# Altium project LOAD CONTROL_Final.PrjPcb
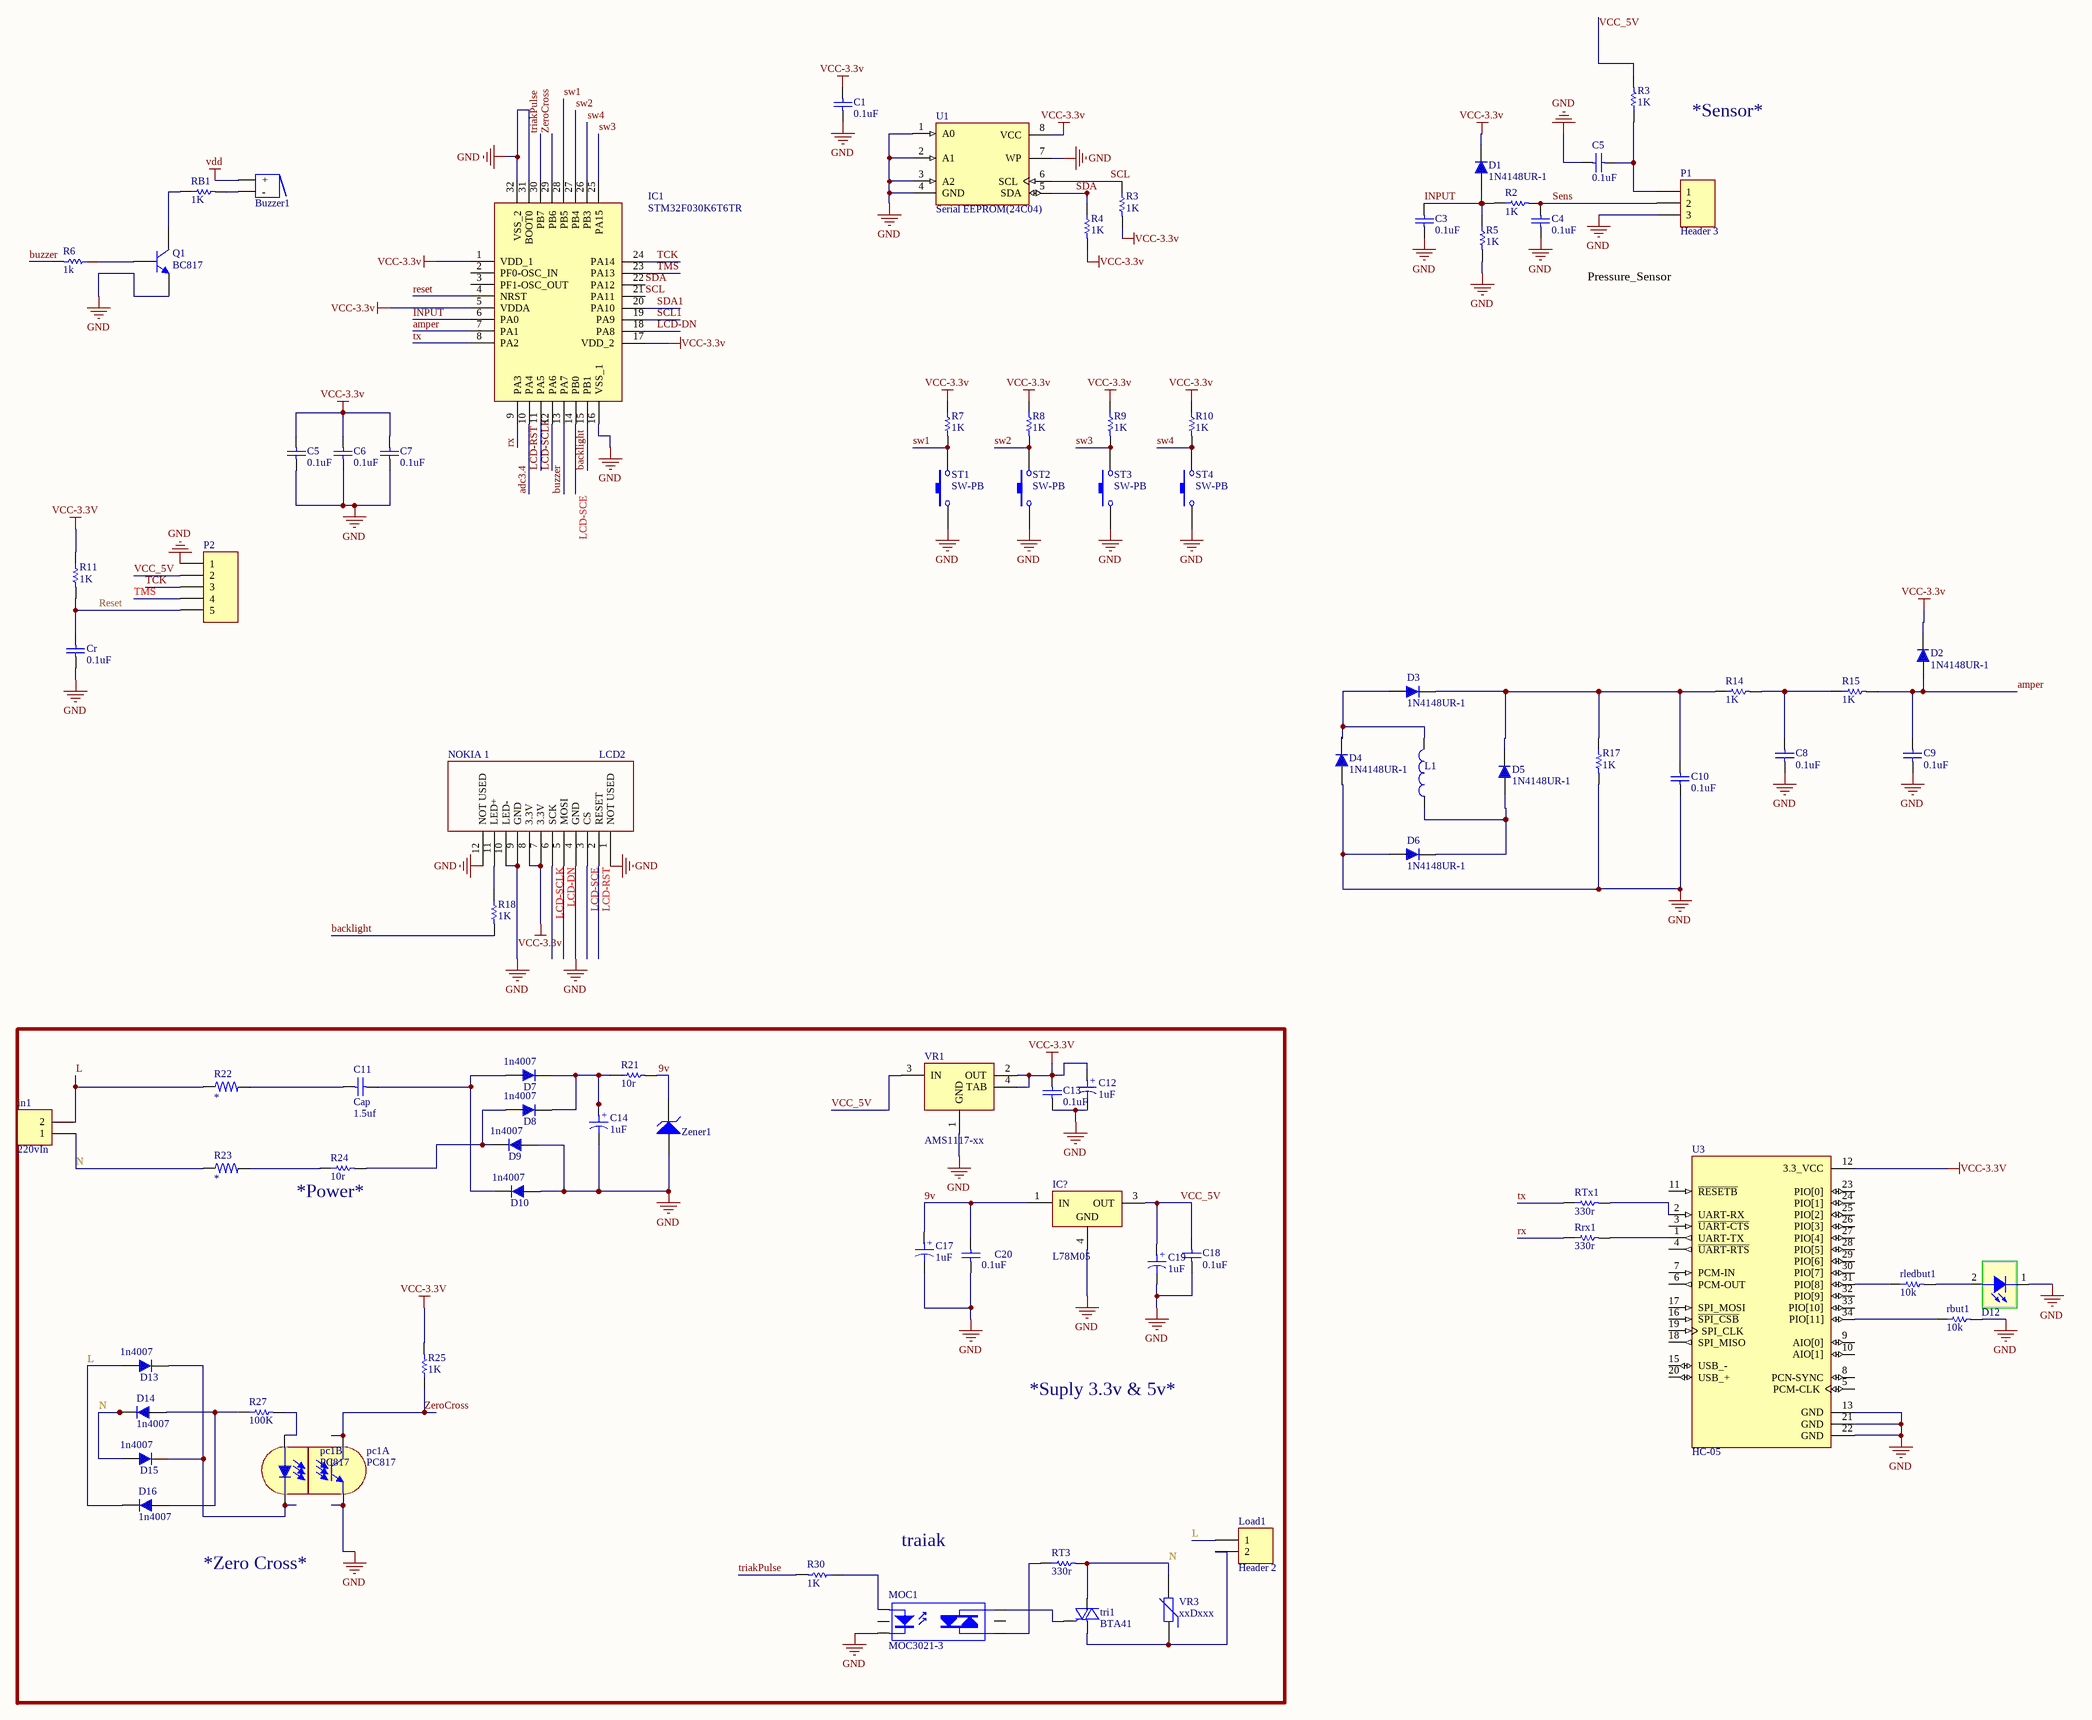
[diagram p0: LOAD CONTROL_Final2.SchDoc]
1 sheet, 84 parts. Net scope: global (net labels, ports and power ports of the same name join across sheets).
Board file: LOAD CONTROL_Final2.PcbDoc

## Sheet LOAD CONTROL_Final2.SchDoc
size A2

### Parts
(Parts that share a designator on the sheet are numbered #1, #2 ... from top to bottom, then left to right.)
Buzzer1  Buzzer  [BUZZER]  (value not drawn)
C1  0.1uF  [CAPC4817X12N]
C3  0.1uF  [CAPC4817X12N]
C4  0.1uF  [CAPC4817X12N]
C5#1  0.1uF  [CAPC4817X12N]
C5#2  0.1uF  [CAPC4817X12N]
C6  0.1uF  [CAPC4817X12N]
C7  0.1uF  [CAPC4817X12N]
C8  0.1uF  [CAPC4817X12N]
C9  0.1uF  [CAPC4817X12N]
C10  0.1uF  [CAPC4817X12N]
C11  Cap  value 1.5uf  [RAD-0.3]
C12  1uF  [Cap electrolitic radial 5x11-2]
C13  0.1uF  [CAPC4817X12N]
C14  1uF  [Cap electrolitic radial 5x11-2]
C17  1uF  [Cap electrolitic radial 5x11-2]
C18  0.1uF  [CAPC4817X12N]
C19  1uF  [Cap electrolitic radial 5x11-2]
C20  0.1uF  [CAPC4817X12N]
Cr  0.1uF  [CAPC4817X12N]
D1  1N4148UR-1  [SOD80, LL-34]
D2  1N4148UR-1  [SOD80, LL-34]
D3  1N4148UR-1  [SOD80, LL-34]
D4  1N4148UR-1  [SOD80, LL-34]
D5  1N4148UR-1  [SOD80, LL-34]
D6  1N4148UR-1  [SOD80, LL-34]
D7  1n4007  [DIOM4629X24N]
D8  1n4007  [DIOM4629X24N]
D9  1n4007  [DIOM4629X24N]
D10  1n4007  [DIOM4629X24N]
D12  SMD 1206 LED  [LED 1206]  (value not drawn)
D13  1n4007  [DIOM4629X24N]
D14  1n4007  [DIOM4629X24N]
D15  1n4007  [DIOM4629X24N]
D16  1n4007  [DIOM4629X24N]
IC1  STM32F030K6T6TR  [QFP80P900X900X160-32N]
IC?  L78M05  [TO-263]
in1  220vIn  [HDR1X2]
L1  0  [ZMC]  (value not drawn)
Load1  Header 2  [HDR1X2]
MOC1  MOC3021-3  [DIP-6]
NOKIA_1  LCD2  [LCD NOKIA 1202]
P1  Header 3  [3PIN]
P2  Header 5  [HDR1X5]  (value not drawn)
pc1  PC817  [SMT Gullwing Lead-Form]  (parts A,B of 2)
Q1  BC817  [SOT23_N]
R2  1K  [RESC4817X04N]
R3#1  1K  [RESC4817X04N]
R3#2  1K  [RESC4817X04N]
R4  1K  [RESC4817X04N]
R5  1K  [RESC4817X04N]
R6  value 1k  [R1206]  (hidden comment: Res Semi)
R7  1K  [RESC4817X04N]
R8  1K  [RESC4817X04N]
R9  1K  [RESC4817X04N]
R10  1K  [RESC4817X04N]
R11  1K  [RESC4817X04N]
R14  1K  [RESC4817X04N]
R15  1K  [RESC4817X04N]
R17  1K  [RESC4817X04N]
R18  1K  [RESC4817X04N]
R21  10r  [RES-(1/2)-Stand]
R22  1614997-1  [RESAD640W45L370D200]  (value not drawn)
R23  1614997-1  [RESAD640W45L370D200]  (value not drawn)
R24  10r  [RES-(1/2)-Stand]
R25  1K  [RESC4817X04N]
R27  100K  [RESC4817X04N]
R30  1K  [RESC4817X04N]
RB1  1K  [RESC4817X04N]
rbut1  10k  [RESC4817X04N]
rledbut1  10k  [RESC4817X04N]
Rrx1  330r  [RESC4817X04N]
RT3  330r  [RESC4817X04N]
RTx1  330r  [RESC4817X04N]
ST1  SW-PB  [PUSH BOTTOM 6*6]
ST2  SW-PB  [PUSH BOTTOM 6*6]
ST3  SW-PB  [PUSH BOTTOM 6*6]
ST4  SW-PB  [PUSH BOTTOM 6*6]
tri1  BTA41  [TO552P1530X450X2110-3B]
U1  Serial EEPROM(24C04)  [SO8_L]
U3  HC-05  [XCVR_HC-05]
VR1  AMS1117-xx  [SOT-223]
VR3  xxDxxx  [14D XXX]
Zener1  Diode Zener  [Diode 1W_Stand]  (value not drawn)

### Nets
GND: C1.1 C3.1 C4.1 C5#1.2 C5#2.1 C6.1 C7.1 C8.1 C9.1 C10.1 C12.2 C13.1 C14.2 C17.2 C18.1 C19.2 C20.1 Cr.1 D4.1 D6.1 D9.1 D10.1 D12.1 IC1.16(VSS_1) IC1.31(BOOT0) IC1.32(VSS_2) IC?.4(GND) MOC1.2(K) NOKIA_1.1(NOT_USED) NOKIA_1.4(GND) NOKIA_1.9(GND) NOKIA_1.10(LED-) NOKIA_1.12(NOT_USED) P1.3 P2.1 pc1.3(E) Q1.2(E) R5.2 R17.2 rbut1.2 ST1.1 ST2.1 ST3.1 ST4.1 U1.1(A0) U1.2(A1) U1.3(A2) U1.4(GND) U1.7(WP) U3.13(GND) U3.21(GND) U3.22(GND) VR1.1(GND) Zener1.1(A)
VCC-3.3v: C1.2 C5#2.2 C6.2 C7.2 C12.1 C13.2 D1.2 D2.2 IC1.1(VDD_1) IC1.5(VDDA) IC1.17(VDD_2) NOKIA_1.7(3.3V) NOKIA_1.8(3.3V) R3#2.2 R4.2 R7.1 R8.1 R9.1 R10.1 R11.1 R25.2 U1.8(VCC) U3.12(3.3_VCC) VR1.2(OUT) VR1.4(TAB)
vdd: Buzzer1.1(+)
9v: C17.1 C20.2 IC?.1(IN) R21.2 Zener1.2(K)
adc3.4: IC1.10(PA4)
amper: C9.2 D2.1 IC1.7(PA1) R15.2
backlight: IC1.15(PB1) R18.2
buzzer: IC1.13(PA7) R6.2
INPUT: C3.2 D1.1 IC1.6(PA0) R2.1 R5.1
L: D13.1 D16.2 in1.2 Load1.1 R22.1
LCD-DN: IC1.18(PA8) NOKIA_1.5(MOSI)
LCD-RST: IC1.11(PA5) NOKIA_1.2(RESET)
LCD-SCE: IC1.14(PB0) NOKIA_1.3(CS)
LCD-SCLK: IC1.12(PA6) NOKIA_1.6(SCK)
N: D14.2 D15.1 in1.1 R23.1 RT3.2 tri1.2(A2) VR3.2
Reset: Cr.2 IC1.4(NRST) P2.5 R11.2
rx: IC1.9(PA3) Rrx1.1
SCL: IC1.21(PA11) R3#2.1 U1.6(SCL)
SCL1: IC1.19(PA9)
SDA: IC1.22(PA12) R4.1 U1.5(SDA)
SDA1: IC1.20(PA10)
Sens: C4.2 P1.2 R2.2
sw1: IC1.28(PB5) R7.2 ST1.2
sw2: IC1.27(PB4) R8.2 ST2.2
sw3: IC1.25(PA15) R9.2 ST3.2
sw4: IC1.26(PB3) R10.2 ST4.2
TCK: IC1.24(PA14) P2.3
TMS: IC1.23(PA13) P2.4
triakPulse: IC1.30(PB7) R30.2
tx: IC1.8(PA2) RTx1.1
VCC_5V: C18.2 C19.1 IC?.3(OUT) P2.2 R3#1.2 VR1.3(IN)
ZeroCross: IC1.29(PB6) pc1.4(C) R25.1
NetBuzzer1_2: Buzzer1.2(-) RB1.2
NetC5#1_1: C5#1.1 P1.1 R3#1.1
NetC8_2: C8.2 R14.2 R15.1
NetC10_2: C10.2 D3.2 D5.2 R14.1 R17.1
NetC11_1: C11.1 R22.2
NetC11_2: C11.2 D7.1 D10.2
NetC14_1: C14.1 D7.2 D8.2 R21.1
NetD3_1: D3.1 D4.2 L1.2
NetD5_1: D5.1 D6.2 L1.1
NetD8_1: D8.1 D9.2 R24.2
NetD12_2: D12.2 rledbut1.2
NetD13_2: D13.2 D15.2 pc1.2(K)
NetD14_1: D14.1 D16.1 R27.1
NetLoad1_2: Load1.2 tri1.1(A1) VR3.1
NetMOC1_1: MOC1.1(A) R30.1
NetMOC1_4: MOC1.4(A/K) tri1.3(G)
NetMOC1_6: MOC1.6(A/K) RT3.1
NetNOKIA_1_11: NOKIA_1.11(LED+) R18.1
Netpc1_1: pc1.1(A) R27.2
NetQ1_1: Q1.1(B) R6.1
NetQ1_3: Q1.3(C) RB1.1
NetR23_2: R23.2 R24.1
Netrbut1_1: rbut1.1 U3.34(PIO[11])
Netrledbut1_1: rledbut1.1 U3.31(PIO[8])
NetRrx1_2: Rrx1.2 U3.1(UART-TX)
NetRTx1_2: RTx1.2 U3.2(UART-RX)

Not connected (* = marked no-connect by the designer): IC1 2(PF0-OSC_IN) 3(PF1-OSC_OUT); MOC1 3(NC) 5(NC); U3 3(~{UART-CTS}) 4(~{UART-RTS}) 5(PCM-CLK) 6(PCM-OUT) 7(PCM-IN) 8(PCN-SYNC) 9(AIO[0]) 10(AIO[1]) 11(~{RESETB}) 15(USB_-) 16(~{SPI_CSB}) 17(SPI_MOSI) 18(SPI_MISO) 19(SPI_CLK) 20(USB_+) 23(PIO[0]) 24(PIO[1]) 25(PIO[2]) 26(PIO[3]) 27(PIO[4]) 28(PIO[5]) 29(PIO[6]) 30(PIO[7]) 32(PIO[9]) 33(PIO[10])

### Notes on the sheet
- *Sensor*
- Pressure_Sensor
- (near R24) *Power*
- *Suply 3.3v & 5v*
- traiak
- *Zero Cross*
- (in symbol Cap ELECTROLITIC TOTAL SIZE) +

### Library data of the parts
Buzzer1 = Buzzer: Designer: Seyed Mohsen Ghasemain; ComponentLinkURL: www.picpars.com
C1 C3 C4 C5#1 C5#2 C6-C10 C13 C18 C20 Cr = CAP SMD 1206: CAP 1206; Designer: Abbas Basereh; Desc.: CAP SMD 1206; Data: 16-12-2016
C11 = Cap: Capacitor; Published: 8-Jun-2000; LatestRevisionDate: 17-Jul-2002; LatestRevisionNote: Re-released for DXP Platform.; PackageReference: RAD-0.3; Publisher: Altium Limited; PackageDescription: Radial Cap, Thru-Hole; 2 Leads; 0.3 in Pin Spacing
C12 C14 C17 C19 = Cap ELECTROLITIC TOTAL SIZE: Cap electrolitic radial; Designer: Abbas Basereh; Data: 16-12-2016; Part. No: *; VALUE: 1uF
D1-D6 = 1N4148UR-1: DIODE GEN PURP 75V 200MA DO213AA; Published: 2017-1-12; PackageVersion: 2017-1-12; PackageReference: DO-213AA&SOD-80; Publisher: Abbas Basereh; PackageDescription: DIODE GEN PURP 75V 200MA DO213AA; ComponentLink1Description: Manufacturer Link; ComponentLink1URL: http://www.digikey.com/product-detail/en/microsemi-corporation/1N4148UR-1/1N4148UR-1-ND/4377991; ComponentLink2Description: Datasheet; PART.NO: 1N4148UR-1
D7-D10 D13-D16 = 1n4007 SMD M7: Standard Rectifiers; Part. No: M7; Manufacturer: DC COMPONENTS; Designer: Abbas Basereh; Link: http://www.tme.eu/en/details/m7/smd-universal-diodes/dc-components/; Link: https://www.aliexpress.com/item/Smd-tube-1n4007-m7-SMA/1213719741.html?spm=2114.01010208.3.1.ZyZ7bC&ws_ab_test=searchweb0_0,searchweb201602_4_10065_10068_10084_10083_10080_10082_10081_10060_10061_10062_10056_10055_10054_10059_10099_10078_10079_427_10073_10103_10102_10096_10052_10050_10051,searchweb201603_4&btsid=db2be5ca-e560-400a-b91c-484ab5ee228b; Data: 16-12-2016
  D7: Value: 1n4007
D12 = LED SMD 1206
IC1 = STM32F030K6T6TR: Integrated Circuit; Manufacturer_Name: STMicroelectronics; Datasheet Link: http://www.st.com/content/ccc/resource/technical/document/datasheet/a4/5d/0b/0e/87/c4/4d/71/DM00088500.pdf/files/DM00088500.pdf/jcr:content/translations/en.DM00088500.pdf; Height: 1.6mm; Manufacturer_Part_Number: STM32F030K6T6TR; Mouser Part Number: 511-STM32F030K6T6TR; Mouser Price/Stock: https://www.mouser.co.uk/ProductDetail/STMicroelectronics/STM32F030K6T6TR/?qs=9MuLHSklicort60U4QZudQ%3D%3D; Arrow Part Number: STM32F030K6T6TR; Arrow Price/Stock: https://www.arrow.com/en/products/stm32f030k6t6tr/stmicroelectronics
IC? = L78M05: Precision 500mA Regulator
in1 Load1 = Header 2: Header, 2-Pin; LatestRevisionDate: 17-Jul-2002; LatestRevisionNote: Re-released for DXP Platform.; Publisher: Altium Limited
L1 = Inductor: Code_IEC: 1005; Value: 300uH; Published: 8-Jun-2000; LatestRevisionDate: 29-May-2009; LatestRevisionNote: IPC-7351 Footprint Added.; PackageReference: 0402-A; Publisher: Altium Limited; PackageDescription: Chip Inductor; Code_JEITA: 0402
MOC1 = MOC3021-3: Opto-Triac; Designer: Seyed Mohsen Ghasemian; E-mail: picpars@gmail.com; Published: 17-11-2011; LatestRevisionDate: 17-11-2011; Publisher: www.picpars.com; WEB: www.picpars.com
NOKIA_1 = NOKIA 1202
P1 = Header 3: Header, 3-Pin; LatestRevisionDate: 17-Jul-2002; LatestRevisionNote: Re-released for DXP Platform.; Publisher: Altium Limited
P2 = Header 5: Header, 5-Pin; LatestRevisionDate: 17-Jul-2002; LatestRevisionNote: Re-released for DXP Platform.; Publisher: Altium Limited
pc1 = PC817XI: DIP 4pin General Purpose  Photocoupler; Published: 2017-2-27; DatasheetVersion: 2017-2-27; PackageVersion: 2017-2-27; PackageReference: SMT Gullwing Lead-Form; Publisher: Abbas Basereh; PackageDescription: SOP, 4-Leads, Body 4/65x6/75mm, Pitch 2/54mm, IPC Medium Density designer:abbas basereh; ComponentLink1Description: Manufacturer Link; ComponentLink1URL: http://www.roboeq.ir/files/id/233/name/PC817.pdf/; ComponentLink2Description: DIP 4pin General Purpose
Q1 = BC817: 45 V, 500 mA NPN general-purpose transistors; Published: 2017-2-8; LatestRevisionDate: 2017; LatestRevisionNote: IPC-7351 Footprint Added.; DatasheetVersion: 2017; PackageVersion: 2017-2-8; PackageReference: SOT23; Publisher: Abbas Basereh; PackageDescription: 3-Pin SOT-23 Package 0.95 mm Pitch, 2.3 mm Lead Span; ComponentLink1Description: Manufacturer Link; ComponentLink1URL: http://www.nxp.com/; ComponentLink2Description: Datasheet; ComponentLink2URL: http://www.nxp.com/
R2 R3#1 R3#2 R4 R5 R7-R11 R14 R15 R17 R18 R25 R27 R30 RB1 rbut1 rledbut1 Rrx1 RT3 RTx1 = RES 1206 0.25W: RES 1206; Designer: Abbas Basereh; Desc.: RES SMD 1206; Data: 16-12-2016
  R2 R3#1 R3#2 R4 R5 R7-R11 R14 R15 R17 R18 R25 RB1: Value: 1k
  R27: Value: 100k
R6 = Res Semi: Semiconductor Resistor; Published: 8-Jun-2000; LatestRevisionDate: 17-Jul-2002; LatestRevisionNote: Re-released for DXP Platform.; PackageReference: AXIAL-0.5; Publisher: Altium Limited
R21 R24 = RES DIP PACKAGE: TOTAL DIP RESISTOR PACK; Designer: Ali Hafizi; Value: 10r
R22 R23 = LR0204F13K3: 13.3 kOhms Â±1% 0.25W, 1/4W Through Hole Resistor Axial - Metal Film; MF: TE Connectivity Passive Product; SnapEDA_Link: https://www.snapeda.com/parts/LR0204F13K3/TE/view-part/?ref=snap; Package: Axial TE Connectivity Passive Product; Value: *; MP: LR0204F13K3; Check_prices: https://www.snapeda.com/parts/LR0204F13K3/TE/view-part/?ref=eda; Comment_1: *
ST1-ST4 = SW-PB: Switch; Published: 24-Mar-1999; LatestRevisionDate: 17-Jul-2002; LatestRevisionNote: Re-released for DXP Platform.; PackageReference: SPST-2; Publisher: Altium Limited; PackageDescription: Switch; 2 Leads
tri1 = BTA41-600A: Thyristors, Discretes (diodes, transistors, thyristors ...), Semiconductors and Actives, original, triac, thyristors; MF: STMicroelectronics; SnapEDA_Link: https://www.snapeda.com/parts/BTA41-600A/STMicroelectronics/view-part/?ref=snap; Package: TOP-3 STMicroelectronics; Value: *; MP: BTA41-600A; Check_prices: https://www.snapeda.com/parts/BTA41-600A/STMicroelectronics/view-part/?ref=eda
U1 = AT24C512: EEPROM
U3 = HC-05: Bluetooth to Serial Port Module; MF: ITead Studio; SnapEDA_Link: https://www.snapeda.com/parts/HC-05/ITEAD/view-part/?ref=snap; Package: Module ITead Studio; Value: *; MP: HC-05; Check_prices: https://www.snapeda.com/parts/HC-05/ITEAD/view-part/?ref=eda
VR1 = AMS1117
VR3 = VARISTOR (VDR): VARISTORS; Manufacturer: china-canada-philipina; Designer: Abbas Basereh; Models: MOV-VDR-COV; Data: 2017-1-5; Link: digikey.com; VALUE: xxDxxx; PUBLISHER: ABBAS BASEREH
Zener1 = Diode Zener: Zener Diode; Designer: Saeid Jorablo; Company: E.P.I.L; Voltage: 3.3 V; Design Date: 2011/11/02